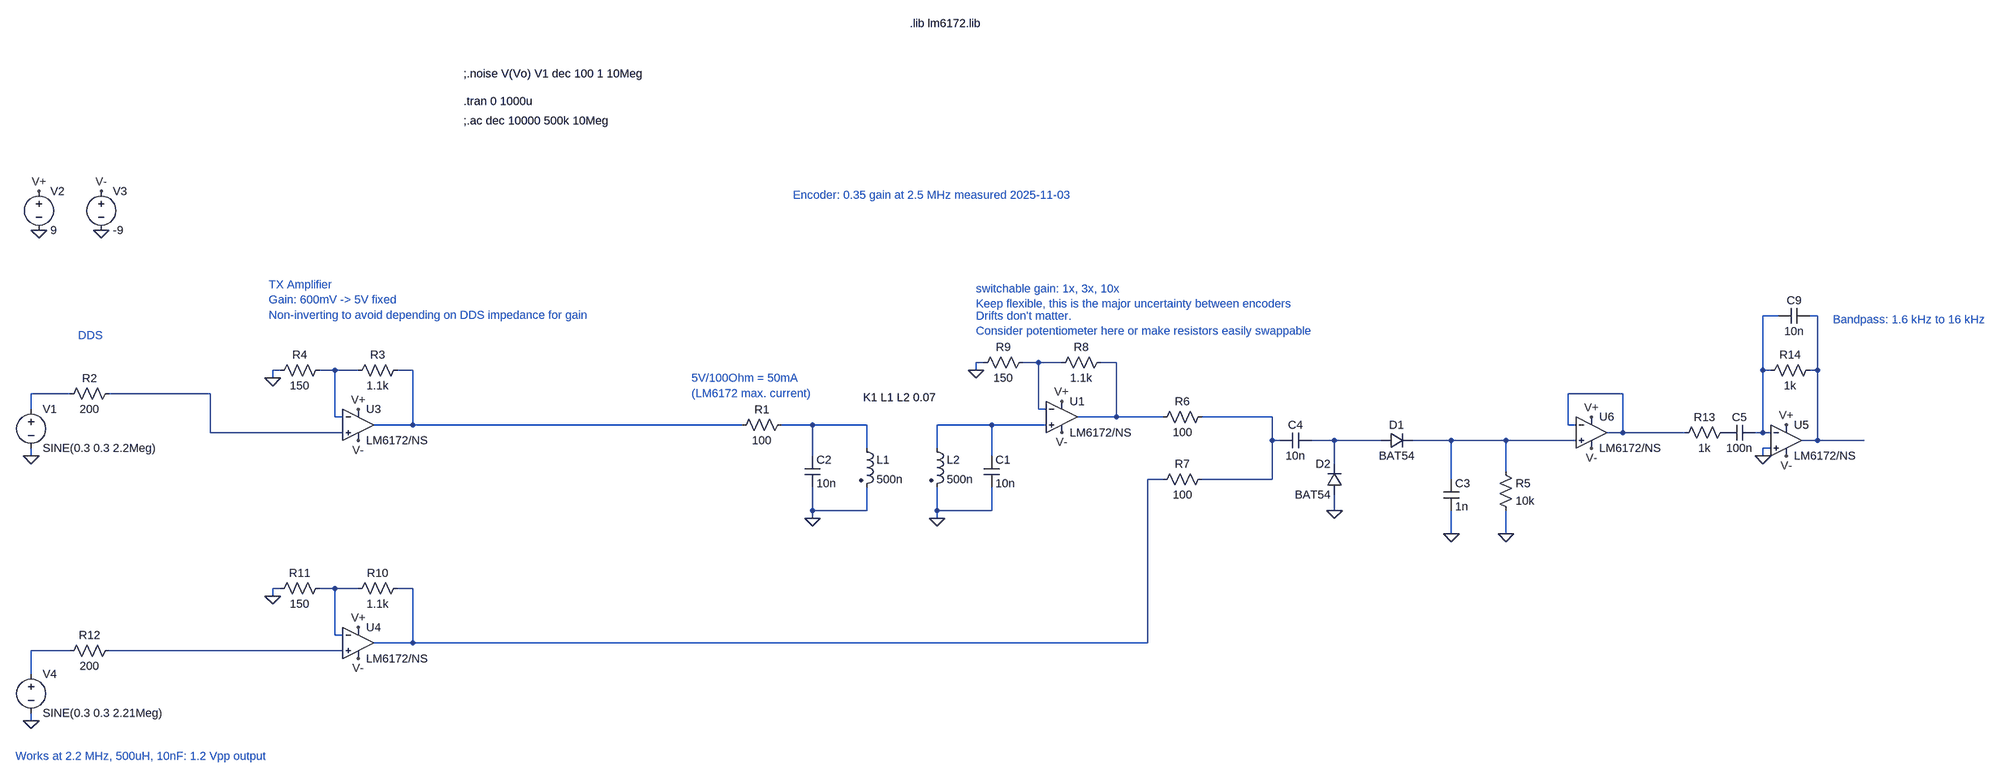
[diagram p0: schematic 2025-08-13_system-model.asc]
2025-08-13_system-model.asc, the LTspice schematic file:
Version 4
SHEET 1 4508 1504
WIRE 3232 -368 3200 -368
WIRE 3312 -368 3296 -368
WIRE 1600 -272 1584 -272
WIRE 1712 -272 1680 -272
WIRE 1760 -272 1712 -272
WIRE 1872 -272 1840 -272
WIRE 112 -256 96 -256
WIRE 224 -256 192 -256
WIRE 272 -256 224 -256
WIRE 384 -256 352 -256
WIRE 1584 -256 1584 -272
WIRE 3200 -256 3200 -368
WIRE 3216 -256 3200 -256
WIRE 3312 -256 3312 -368
WIRE 3312 -256 3296 -256
WIRE 96 -240 96 -256
WIRE -320 -208 -400 -208
WIRE -32 -208 -240 -208
WIRE 2912 -208 2800 -208
WIRE -400 -176 -400 -208
WIRE 1712 -176 1712 -272
WIRE 1728 -176 1712 -176
WIRE 224 -160 224 -256
WIRE 240 -160 224 -160
WIRE 1872 -160 1872 -272
WIRE 1872 -160 1792 -160
WIRE 1968 -160 1872 -160
WIRE 2192 -160 2048 -160
WIRE 384 -144 384 -256
WIRE 384 -144 304 -144
WIRE 1104 -144 384 -144
WIRE 1248 -144 1184 -144
WIRE 1360 -144 1248 -144
WIRE 1616 -144 1504 -144
WIRE 1728 -144 1616 -144
WIRE 2800 -144 2800 -208
WIRE 2816 -144 2800 -144
WIRE -32 -128 -32 -208
WIRE 240 -128 -32 -128
WIRE 2912 -128 2912 -208
WIRE 2912 -128 2880 -128
WIRE 3040 -128 2912 -128
WIRE 3200 -128 3200 -256
WIRE 3200 -128 3184 -128
WIRE 3216 -128 3200 -128
WIRE 2192 -112 2192 -160
WIRE 2208 -112 2192 -112
WIRE 2320 -112 2272 -112
WIRE 2416 -112 2320 -112
WIRE 2560 -112 2480 -112
WIRE 2672 -112 2560 -112
WIRE 2816 -112 2672 -112
WIRE 3312 -112 3312 -256
WIRE 3312 -112 3280 -112
WIRE 3408 -112 3312 -112
WIRE 1360 -96 1360 -144
WIRE 1504 -96 1504 -144
WIRE 3216 -96 3200 -96
WIRE -400 -80 -400 -96
WIRE 1248 -80 1248 -144
WIRE 1616 -80 1616 -144
WIRE 3200 -80 3200 -96
WIRE 2320 -64 2320 -112
WIRE 2672 -48 2672 -112
WIRE 1968 -32 1936 -32
WIRE 2192 -32 2192 -112
WIRE 2192 -32 2048 -32
WIRE 2560 -32 2560 -112
WIRE 1248 32 1248 -16
WIRE 1360 32 1360 -16
WIRE 1360 32 1248 32
WIRE 1504 32 1504 -16
WIRE 1616 32 1616 -16
WIRE 1616 32 1504 32
WIRE 2320 32 2320 0
WIRE 1248 48 1248 32
WIRE 1504 48 1504 32
WIRE 2560 80 2560 32
WIRE 2672 80 2672 32
WIRE 112 192 96 192
WIRE 224 192 192 192
WIRE 272 192 224 192
WIRE 384 192 352 192
WIRE 96 208 96 192
WIRE 224 288 224 192
WIRE 240 288 224 288
WIRE 384 304 384 192
WIRE 384 304 304 304
WIRE 1936 304 1936 -32
WIRE 1936 304 384 304
WIRE -320 320 -400 320
WIRE 240 320 -240 320
WIRE -400 368 -400 320
WIRE -400 464 -400 448
FLAG -384 -544 0
FLAG -384 -624 V+
FLAG -256 -544 0
FLAG -256 -624 V-
FLAG -400 -80 0
FLAG 1504 48 0
FLAG 272 -176 V+
FLAG 272 -112 V-
FLAG 96 -240 0
FLAG 1248 48 0
FLAG 2672 80 0
FLAG 2560 80 0
FLAG 2320 32 0
FLAG -400 464 0
FLAG 1760 -192 V+
FLAG 1760 -128 V-
FLAG 1584 -256 0
FLAG 272 272 V+
FLAG 272 336 V-
FLAG 96 208 0
FLAG 3248 -144 V+
FLAG 3248 -80 V-
FLAG 3200 -80 0
FLAG 2848 -160 V+
FLAG 2848 -96 V-
SYMBOL Voltage -384 -640 R0
SYMATTR InstName V2
SYMATTR Value 9
SYMBOL Voltage -256 -640 R0
SYMATTR InstName V3
SYMATTR Value -9
SYMBOL Voltage -400 -192 R0
SYMATTR InstName V1
SYMATTR Value SINE(0.3 0.3 2.2Meg)
SYMATTR Value2 AC 1
SYMBOL ind2 1344 -112 R0
SYMATTR InstName L1
SYMATTR Value 500n
SYMATTR Type ind
SYMATTR SpiceLine Rser=1
SYMBOL ind2 1488 -112 R0
SYMATTR InstName L2
SYMATTR Value 500n
SYMATTR Type ind
SYMATTR SpiceLine Rser=1
SYMBOL Cap 1600 -80 R0
SYMATTR InstName C1
SYMATTR Value 10n
SYMBOL Res 1200 -160 R90
WINDOW 0 0 56 VBottom 2
WINDOW 3 32 56 VTop 2
SYMATTR InstName R1
SYMATTR Value 100
SYMBOL Cap 1232 -80 R0
SYMATTR InstName C2
SYMATTR Value 10n
SYMBOL Res -224 -224 R90
WINDOW 0 0 56 VBottom 2
WINDOW 3 32 56 VTop 2
SYMATTR InstName R2
SYMATTR Value 200
SYMBOL Res 368 -272 R90
WINDOW 0 0 56 VBottom 2
WINDOW 3 32 56 VTop 2
SYMATTR InstName R3
SYMATTR Value 1.1k
SYMBOL Res 208 -272 R90
WINDOW 0 0 56 VBottom 2
WINDOW 3 32 56 VTop 2
SYMATTR InstName R4
SYMATTR Value 150
SYMBOL Res 2656 -64 R0
SYMATTR InstName R5
SYMATTR Value 10k
SYMBOL Cap 2544 -32 R0
SYMATTR InstName C3
SYMATTR Value 1n
SYMBOL Res 2064 -176 R90
WINDOW 0 0 56 VBottom 2
WINDOW 3 32 56 VTop 2
SYMATTR InstName R6
SYMATTR Value 100
SYMBOL Res 2064 -48 R90
WINDOW 0 0 56 VBottom 2
WINDOW 3 32 56 VTop 2
SYMATTR InstName R7
SYMATTR Value 100
SYMBOL diode 2416 -96 R270
WINDOW 0 32 32 VTop 2
WINDOW 3 0 32 VBottom 2
SYMATTR InstName D1
SYMATTR Value BAT54
SYMBOL diode 2336 0 R180
WINDOW 0 24 64 Left 2
WINDOW 3 24 0 Left 2
SYMATTR InstName D2
SYMATTR Value BAT54
SYMBOL Cap 2272 -128 R90
WINDOW 0 0 32 VBottom 2
WINDOW 3 32 32 VTop 2
SYMATTR InstName C4
SYMATTR Value 10n
SYMBOL Voltage -400 352 R0
SYMATTR InstName V4
SYMATTR Value SINE(0.3 0.3 2.21Meg)
SYMATTR Value2 AC 1
SYMBOL OpAmps/opamp2 272 -208 R0
SYMATTR InstName U3
SYMATTR Value LM6172/NS
SYMBOL Res 1856 -288 R90
WINDOW 0 0 56 VBottom 2
WINDOW 3 32 56 VTop 2
SYMATTR InstName R8
SYMATTR Value 1.1k
SYMBOL Res 1696 -288 R90
WINDOW 0 0 56 VBottom 2
WINDOW 3 32 56 VTop 2
SYMATTR InstName R9
SYMATTR Value 150
SYMBOL OpAmps/opamp2 1760 -224 R0
SYMATTR InstName U1
SYMATTR Value LM6172/NS
SYMBOL Res 368 176 R90
WINDOW 0 0 56 VBottom 2
WINDOW 3 32 56 VTop 2
SYMATTR InstName R10
SYMATTR Value 1.1k
SYMBOL Res 208 176 R90
WINDOW 0 0 56 VBottom 2
WINDOW 3 32 56 VTop 2
SYMATTR InstName R11
SYMATTR Value 150
SYMBOL OpAmps/opamp2 272 240 R0
SYMATTR InstName U4
SYMATTR Value LM6172/NS
SYMBOL Res -224 304 R90
WINDOW 0 0 56 VBottom 2
WINDOW 3 32 56 VTop 2
SYMATTR InstName R12
SYMATTR Value 200
SYMBOL OpAmps/opamp2 3248 -176 R0
SYMATTR InstName U5
SYMATTR Value LM6172/NS
SYMBOL Res 3136 -144 R90
WINDOW 0 0 56 VBottom 2
WINDOW 3 32 56 VTop 2
SYMATTR InstName R13
SYMATTR Value 1k
SYMBOL Cap 3184 -144 R90
WINDOW 0 0 32 VBottom 2
WINDOW 3 32 32 VTop 2
SYMATTR InstName C5
SYMATTR Value 100n
SYMBOL Res 3312 -272 R90
WINDOW 0 0 56 VBottom 2
WINDOW 3 32 56 VTop 2
SYMATTR InstName R14
SYMATTR Value 1k
SYMBOL OpAmps/opamp2 2848 -192 R0
SYMATTR InstName U6
SYMATTR Value LM6172/NS
SYMBOL Cap 3296 -384 R90
WINDOW 0 0 32 VBottom 2
WINDOW 3 32 32 VTop 2
SYMATTR InstName C9
SYMATTR Value 10n
TEXT -304 -328 Left 2 ;DDS
TEXT 88 -432 Left 2 ;TX Amplifier\nGain: 600mV -> 5V fixed\nNon-inverting to avoid depending on DDS impedance for gain
TEXT 1352 -200 Left 2 !K1 L1 L2 0.07
TEXT 1208 -616 Left 2 ;Encoder: 0.35 gain at 2.5 MHz measured 2025-11-03
TEXT 488 -864 Left 2 !.tran 0 1000u
TEXT 488 -920 Left 2 !;.noise V(Vo) V1 dec 100 1 10Meg
TEXT 488 -824 Left 2 !;.ac dec 10000 500k 10Meg
TEXT 1448 -1024 Left 2 !.lib lm6172.lib
TEXT 1584 -424 Left 2 ;switchable gain: 1x, 3x, 10x\nKeep flexible, this is the major uncertainty between encoders
TEXT 1000 -240 Left 2 ;5V/100Ohm = 50mA\n(LM6172 max. current)
TEXT -432 536 Left 2 ;Works at 2.2 MHz, 500uH, 10nF: 1.2 Vpp output
TEXT 1584 -368 Left 2 ;Drifts don't matter.\nConsider potentiometer here or make resistors easily swappable
TEXT 3344 -360 Left 2 ;Bandpass: 1.6 kHz to 16 kHz

The netlist it stands for:
* 2025-08-13_system-model.asc
V2 V+ 0 9
V3 V- 0 -9
V1 N007 0 SINE(0.3 0.3 2.2Meg) AC 1
L1 N011 0 500n Rser=1
L2 N012 0 500n Rser=1
C1 N012 0 10n
R1 N011 N006 100
C2 N011 0 10n
R2 N008 N007 200
R3 N006 N005 1.1k
R4 N005 0 150
R5 N014 0 10k
C3 N014 0 1n
R6 N010 N004 100
R7 N010 N015 100
D1 N013 N014 BAT54
D2 0 N013 BAT54
C4 N013 N010 10n
V4 N017 0 SINE(0.3 0.3 2.21Meg) AC 1
XU3 N008 N005 V+ V- N006 LM6172/NS  ; pins In+ In- V+ V- OUT
R8 N004 N003 1.1k
R9 N003 0 150
XU1 N012 N003 V+ V- N004 LM6172/NS  ; pins In+ In- V+ V- OUT
R10 N015 N016 1.1k
R11 N016 0 150
XU4 N018 N016 V+ V- N015 LM6172/NS  ; pins In+ In- V+ V- OUT
R12 N018 N017 200
XU5 0 N001 V+ V- N002 LM6172/NS  ; pins In+ In- V+ V- OUT
R13 P001 N009 1k
C5 N001 P001 100n
R14 N002 N001 1k
XU6 N014 N009 V+ V- N009 LM6172/NS  ; pins In+ In- V+ V- OUT
C9 N002 N001 10n
.model D D
.lib standard.dio
* DDS
* TX Amplifier
* Gain: 600mV -> 5V fixed
* Non-inverting to avoid depending on DDS impedance for gain
K1 L1 L2 0.07
* Encoder: 0.35 gain at 2.5 MHz measured 2025-11-03
.tran 0 1000u
;.noise V(Vo) V1 dec 100 1 10Meg
;.ac dec 10000 500k 10Meg
.lib lm6172.lib
* switchable gain: 1x, 3x, 10x
* Keep flexible, this is the major uncertainty between encoders
* 5V/100Ohm = 50mA
* (LM6172 max. current)
* Works at 2.2 MHz, 500uH, 10nF: 1.2 Vpp output
* Drifts don't matter.
* Consider potentiometer here or make resistors easily swappable
* Bandpass: 1.6 kHz to 16 kHz
.backanno
.end